# Altium schematic sheet 09-modem3.SchDoc: Modem
size Letter; DrawnBy: J. Brinton; Engineer: J. Brinton; Revision: 1; SheetNumber: 9; SheetTotal: 14
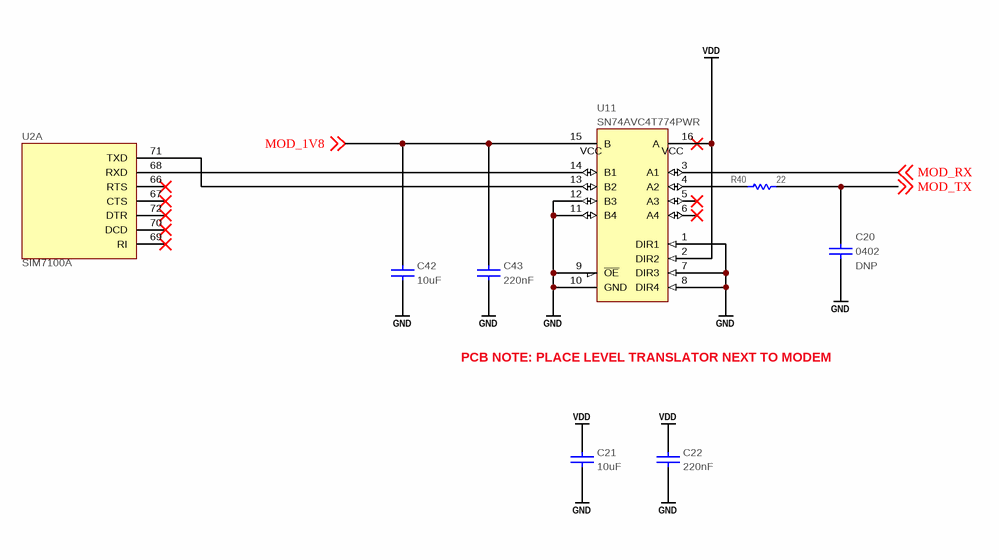
[diagram p0: 09-modem3.SchDoc]

## Parts
C20  Package: 0402  Do Not Place: DNP  [CAPC100X50X55L25N]  (hidden comment: VJ0402A101KXA)
C21  value 10uF  [CAPC200X125X145L45N]  (hidden comment: CL21B106KOQNNNE)
C22  value 220nF  [CAPC100X50X55L25N]  (hidden comment: C1005X7R1E224K050BE)
C42  value 10uF  [CAPC200X125X145L45N]  (hidden comment: CL21B106KOQNNNE)
C43  value 220nF  [CAPC100X50X55L25N]  (hidden comment: C1005X7R1E224K050BE)
R40  value 22  [RESC2012X70N]  (hidden comment: ERJ-6ENF22R0V)
U2  SIM7100A  [SIM7100A]  (part A of 10)
U11  SN74AVC4T774PWR  [TSSOP16]

## Nets
GND: C20.2 C21.2 C22.2 C42.2 C43.2 U11.1(DIR1) U11.7(DIR3) U11.8(DIR4) U11.9(~{OE}) U11.10(GND) U11.11(B4) U11.12(B3)
VDD: C21.1 C22.1 U11.2(DIR2) U11.16(A)
MOD_1V8: C42.1 C43.1 U11.15(B) ; off-sheet MOD_1V8
MOD_RX: U11.3(A1) ; off-sheet MOD_RX
MOD_TX: C20.1 R40.1 ; off-sheet MOD_TX
NetR40_2: R40.2 U11.4(A2)
NetU2_68: U2.68(RXD) U11.14(B1)
NetU2_71: U2.71(TXD) U11.13(B2)

Not connected (* = marked no-connect by the designer): U2 66(RTS)* 67(CTS)* 69(RI)* 70(DCD)* 72(DTR)*; U11 5(A3)* 6(A4)*

## Notes on the sheet
- PCB NOTE: PLACE LEVEL TRANSLATOR NEXT TO MODEM
- Designed By:
- Title
- Engineer
- Revision
- Drawn By
- Date
- Sheet
- of
- (in symbol SN74AVC4T774PWR) VCC

## Library data of the parts
C20 = VJ0402A101JXA: Ceramic Capacitor 100pF ±10% 50V C0G 0402; Manufacturer: Vishay; Tr: -55:150; Manufacturer P/N: VJ0402A101KXA; Tolerance: ±10%; Value: 100pF; Voltage: 50V
C21 C42 = LMK212B7106KG: Ceramic Capacitor 10uF ±10% 16V X7R 0805; Manufacturer: Samsung; Tr: -55:105; Manufacturer P/N: CL21B106KOQNNNE; Tolerance: ±10%; Package: 0805; Voltage: 16V
C22 C43 = TMK105B7224KV: Ceramic Capacitor 220nF ±10% 25V X7R 0402; Manufacturer: TDK; Manufacturer P/N: C1005X7R1E224K050BE; Tolerance: ±10%; Tr: *; Package: 0402; Voltage: 25V
R40 = RES 0402: Thick Film Resistor 22 ±1% 0805; Manufacturer: Panasonic; Tr: -55:155; Package: 0805; Manufacturer P/N: ERJ-6ENF22R0V; Tolerance: ±1%
U2 = Component_1: Cellular Module; Manufacturer: SIMCOM; Manufacturer P/N: SIM7100A
U11 = SN74AVC4T774PWR: 4-Bit Dual-Supply Bus Transceiver; Manufacturer: Texas Instruments; Manufacturer P/N: SN74AVC4T774PWR